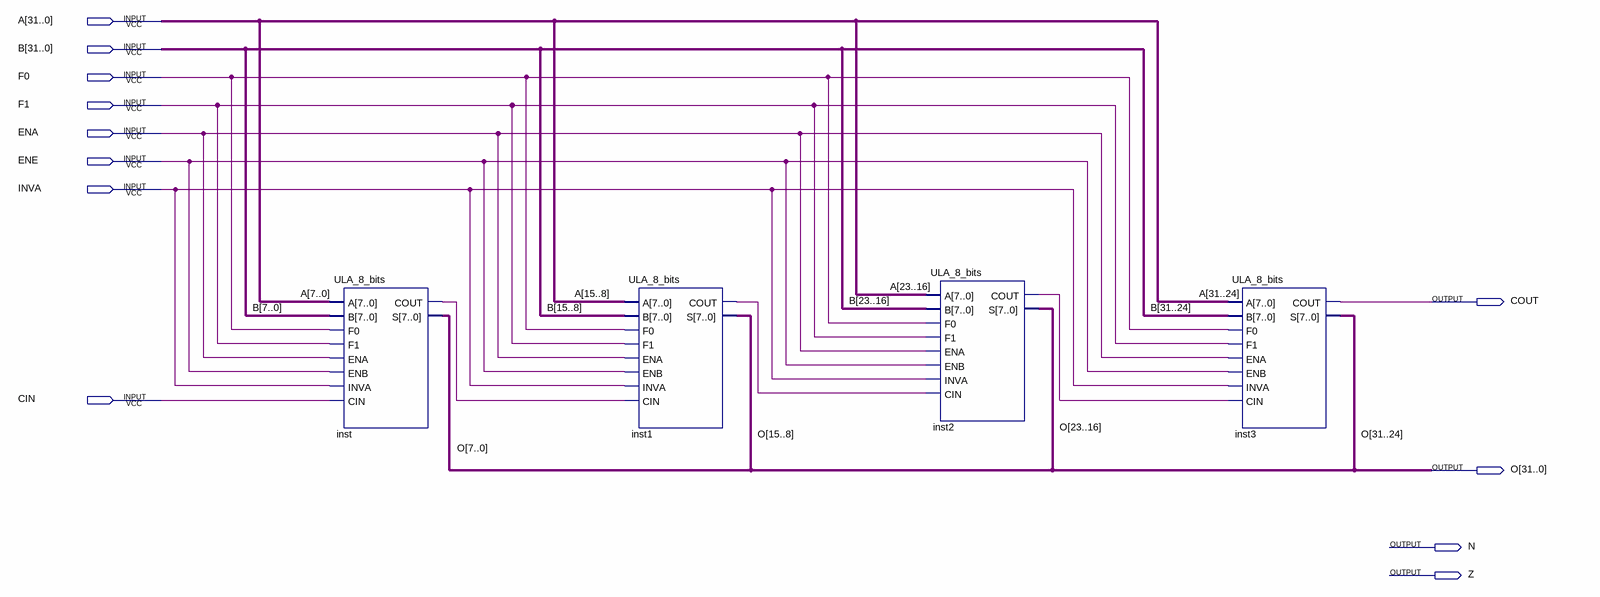
[diagram p0: schematic sheet]
// Quartus schematic ULA_32_bits.bdf as structural Verilog: 4 symbols, 12 pins
module ULA_32_bits (
  input  [31:0] A,
  input  [31:0] B,
  input  F0,
  input  F1,
  input  ENA,
  input  ENE,
  input  INVA,
  input  CIN,
  output COUT,
  output [31:0] O,
  output N,
  output Z
);

  wire inst1_cout, inst2_cout, inst_cout;

  ULA_8_bits inst (
    .A(A[7:0]), .B(B[7:0]), .F0(F0), .F1(F1), .ENA(ENA), .ENB(ENE), .INVA(INVA), .CIN(CIN), .COUT(inst_cout),
    .S(O[7:0]));
  ULA_8_bits inst1 (
    .A(A[15:8]), .B(B[15:8]), .F0(F0), .F1(F1), .ENA(ENA), .ENB(ENE), .INVA(INVA), .CIN(inst_cout),
    .COUT(inst1_cout), .S(O[15:8]));
  ULA_8_bits inst2 (
    .A(A[23:16]), .B(B[23:16]), .F0(F0), .F1(F1), .ENA(ENA), .ENB(ENE), .INVA(INVA), .CIN(inst1_cout),
    .COUT(inst2_cout), .S(O[23:16]));
  ULA_8_bits inst3 (
    .A(A[31:24]), .B(B[31:24]), .F0(F0), .F1(F1), .ENA(ENA), .ENB(ENE), .INVA(INVA), .CIN(inst2_cout),
    .COUT(COUT), .S(O[31:24]));
endmodule
